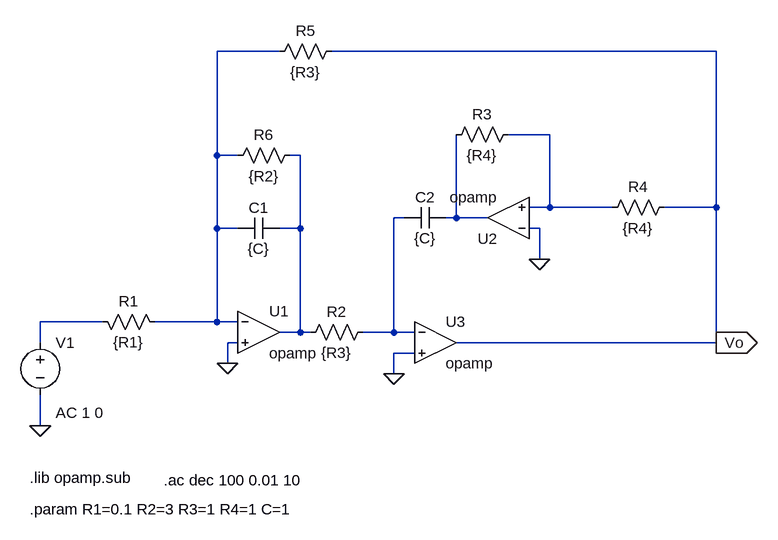
[diagram p0: schematic Circuito.asc]
Circuito.asc, the LTspice schematic file:
Version 4
SHEET 1 1204 680
WIRE 384 -272 288 -272
WIRE 1056 -272 464 -272
WIRE 800 -144 736 -144
WIRE 288 -112 288 -272
WIRE 320 -112 288 -112
WIRE 416 -112 400 -112
WIRE 800 -32 800 -144
WIRE 800 -32 768 -32
WIRE 896 -32 800 -32
WIRE 1056 -32 1056 -272
WIRE 1056 -32 976 -32
WIRE 576 -16 560 -16
WIRE 656 -16 656 -144
WIRE 656 -16 640 -16
WIRE 704 -16 656 -16
WIRE 288 0 288 -112
WIRE 320 0 288 0
WIRE 416 0 416 -112
WIRE 416 0 384 0
WIRE 784 0 768 0
WIRE 784 48 784 0
WIRE 112 144 16 144
WIRE 288 144 288 0
WIRE 288 144 192 144
WIRE 320 144 288 144
WIRE 416 160 416 0
WIRE 416 160 384 160
WIRE 432 160 416 160
WIRE 560 160 560 -16
WIRE 560 160 512 160
WIRE 592 160 560 160
WIRE 16 176 16 144
WIRE 320 176 304 176
WIRE 1056 176 1056 -32
WIRE 1056 176 656 176
WIRE 592 192 560 192
WIRE 304 208 304 176
WIRE 560 224 560 192
WIRE 16 304 16 256
FLAG 16 304 0
FLAG 304 208 0
FLAG 560 224 0
FLAG 784 48 0
FLAG 1056 176 Vo
IOPIN 1056 176 Out
SYMBOL voltage 16 160 R0
WINDOW 123 24 124 Left 2
WINDOW 39 0 0 Left 0
SYMATTR InstName V1
SYMATTR Value ""
SYMATTR Value2 AC 1 0
SYMBOL res 96 128 M90
WINDOW 0 0 56 VBottom 2
WINDOW 3 32 56 VTop 2
SYMATTR InstName R1
SYMATTR Value {R1}
SYMBOL OpAmps\\opamp 352 96 R0
SYMATTR InstName U1
SYMBOL OpAmps\\opamp 624 112 R0
SYMATTR InstName U3
SYMBOL OpAmps\\opamp 736 48 R180
SYMATTR InstName U2
SYMBOL res 528 144 R90
WINDOW 0 0 56 VBottom 2
WINDOW 3 32 56 VTop 2
SYMATTR InstName R2
SYMATTR Value {R3}
SYMBOL res 752 -160 R90
WINDOW 0 0 56 VBottom 2
WINDOW 3 32 56 VTop 2
SYMATTR InstName R3
SYMATTR Value {R4}
SYMBOL res 992 -48 R90
WINDOW 0 0 56 VBottom 2
WINDOW 3 32 56 VTop 2
SYMATTR InstName R4
SYMATTR Value {R4}
SYMBOL res 480 -288 R90
WINDOW 0 0 56 VBottom 2
WINDOW 3 32 56 VTop 2
SYMATTR InstName R5
SYMATTR Value {R3}
SYMBOL cap 384 -16 R90
WINDOW 0 0 32 VBottom 2
WINDOW 3 32 32 VTop 2
SYMATTR InstName C1
SYMATTR Value {C}
SYMBOL res 416 -128 R90
WINDOW 0 0 56 VBottom 2
WINDOW 3 32 56 VTop 2
SYMATTR InstName R6
SYMATTR Value {R2}
SYMBOL cap 640 -32 R90
WINDOW 0 0 32 VBottom 2
WINDOW 3 32 32 VTop 2
SYMATTR InstName C2
SYMATTR Value {C}
TEXT 0 384 Left 2 !.lib opamp.sub
TEXT 0 432 Left 2 !.param R1=0.1 R2=3 R3=1 R4=1 C=1
TEXT 206 388 Left 2 !.ac dec 100 0.01 10

The netlist it stands for:
* Circuito.asc
V1 N006 0 AC 1 0
R1 N006 N001 {R1}
XU1 N001 0 N003 opamp Aol=100K GBW=10Meg  ; pins invin noninvin out
XU3 N004 0 Vo opamp Aol=100K GBW=10Meg  ; pins invin noninvin out
XU2 0 N002 N005 opamp Aol=100K GBW=10Meg  ; pins invin noninvin out
R2 N004 N003 {R3}
R3 N002 N005 {R4}
R4 Vo N002 {R4}
R5 Vo N001 {R3}
C1 N003 N001 {C}
R6 N003 N001 {R2}
C2 N005 N004 {C}
.lib opamp.sub
.param R1=0.1 R2=3 R3=1 R4=1 C=1
.ac dec 100 0.01 10
.backanno
.end